# EAGLE schematic zoommar (EAGLE 5.07)
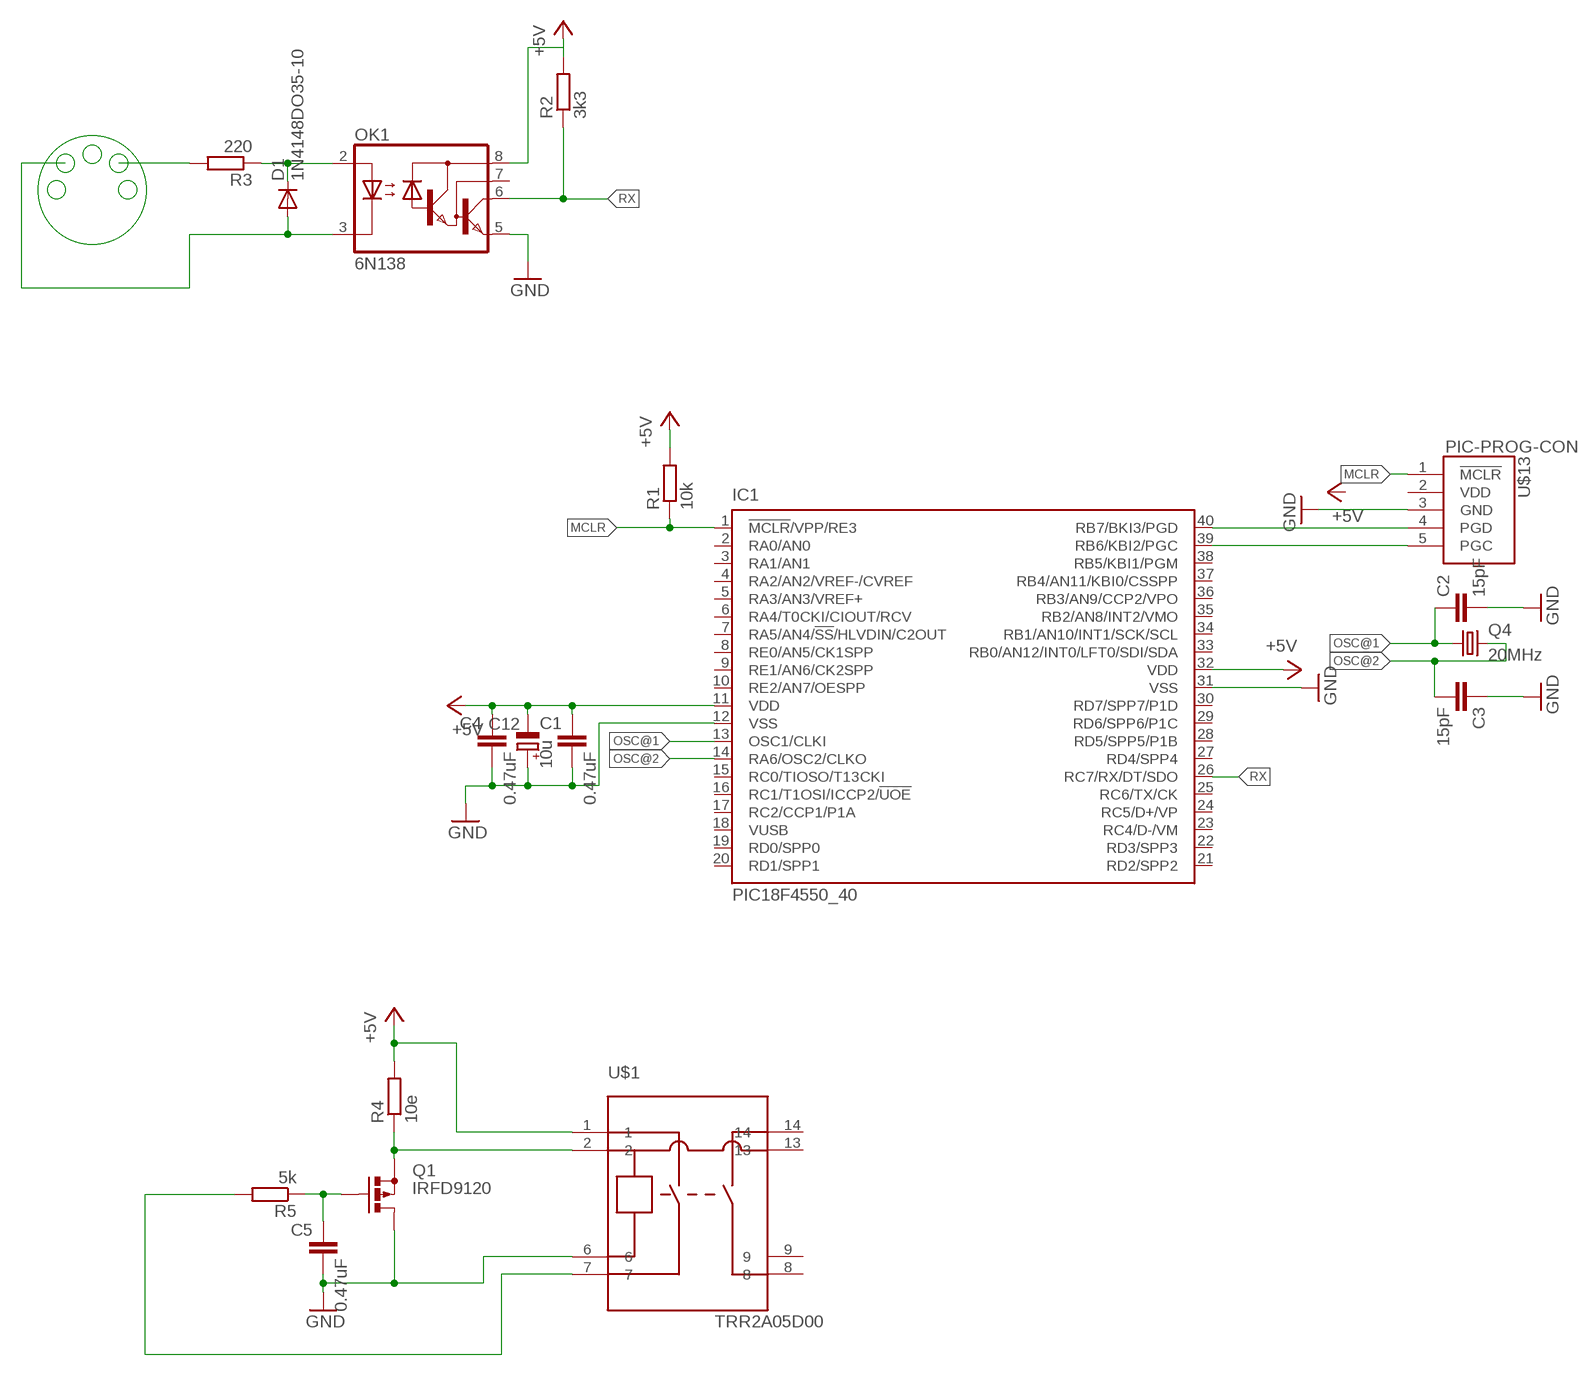
[diagram p0: schematic, sheet 1]

## Parts
C1  0.47uF  C-1206  [C1206]
C2  15pF  C-1206  [C1206]
C3  15pF  C-1206  [C1206]
C4  0.47uF  C-1206  [C1206]
C5  0.47uF  C-1206  [C1206]
C12  10u  CPOL-EUCT3528  [CT3528]
D1  1N4148DO35-10  [DO35-10]
IC1  PIC18F4550_40  [DIL40]
OK1  6N138  [DIL08]
Q1  IRFD9120  [C370-01]
Q4  20MHz  CRYSTALHC49S  [HC49/S]
R1  10k  R-EU_M1206  [M1206]
R2  3k3  R-EU_M1206  [M1206]
R3  220  R-EU_M1206  [M1206]
R4  10e  R-EU_M1206  [M1206]
R5  5k  R-EU_M1206  [M1206]
U$1  TRR2A05D00  [TRR_DIP]
U$13  PIC-PROG-CON  [PIC-PROG-CON]

## Nets
+5V: C1.2 C4.2 C12.- IC1.11(VDD) IC1.32(VDD) OK1.8(VCC) R1.2 R2.2 R4.2 U$1.1
GND [net8]: C1.1 C2.2 C3.1 C4.1 C5.1 C12.+ IC1.12(VSS) IC1.31(VSS) OK1.5(GND) Q1.D1 U$1.6 U$13.3(GND)
MCLR [net8]: IC1.1(!MCLR!/VPP/RE3) R1.1 U$13.1(!MCLR)
N$1: IC1.40(RB7/BKI3/PGD) U$13.4(PGD)
N$2: IC1.39(RB6/KBI2/PGC) U$13.5(PGC)
N$3: Q1.S R4.1 U$1.2
N$4: D1.C OK1.2(A) R3.1
N$5: R3.2
N$6: D1.A OK1.3(C)
N$7: C5.2 Q1.G R5.1
N$10: R5.2 U$1.7
OSC@1 [net8]: C2.1 Q4.1
OSC@2 [net8]: C3.2 Q4.2
RX: IC1.26(RC7/RX/DT/SDO) OK1.6(VO) R2.1
Unconnected: IC1.2(RA0/AN0) IC1.3(RA1/AN1) IC1.4(RA2/AN2/VREF-/CVREF) IC1.5(RA3/AN3/VREF+) IC1.6(RA4/T0CKI/CIOUT/RCV) IC1.7(RA5/AN4/!SS!/HLVDIN/C2OUT) IC1.8(RE0/AN5/CK1SPP) IC1.9(RE1/AN6/CK2SPP) IC1.10(RE2/AN7/OESPP) IC1.13(OSC1/CLKI) IC1.14(RA6/OSC2/CLKO) IC1.15(RC0/TIOSO/T13CKI) IC1.16(RC1/T1OSI/ICCP2/!UOE) IC1.17(RC2/CCP1/P1A) IC1.18(VUSB) IC1.19(RD0/SPP0) IC1.20(RD1/SPP1) IC1.21(RD2/SPP2) IC1.22(RD3/SPP3) IC1.23(RC4/D-/VM) IC1.24(RC5/D+/VP) IC1.25(RC6/TX/CK) IC1.27(RD4/SPP4) IC1.28(RD5/SPP5/P1B) IC1.29(RD6/SPP6/P1C) IC1.30(RD7/SPP7/P1D) IC1.33(RB0/AN12/INT0/LFT0/SDI/SDA) IC1.34(RB1/AN10/INT1/SCK/SCL) IC1.35(RB2/AN8/INT2/VMO) IC1.36(RB3/AN9/CCP2/VPO) IC1.37(RB4/AN11/KBI0/CSSPP) IC1.38(RB5/KBI1/PGM) OK1.7(VB) Q1.D U$1.8 U$1.9 U$1.13 U$1.14 U$13.2(VDD)

## Library data of the parts
C1-C5 = quantum-sensor:C: Capacitor
C12 = rcl:CPOL-EU: POLARIZED CAPACITOR, European symbol
D1 = diode:1N4148: DIODE high speed (Philips)
IC1 = microchip:PIC18F4*_40: USB Microcontrollers with nanoWatt Technology High-Performance, Enhanced Flash, 28/40/44-Pin, Source: http://ww1.microchip.com/downloads/en/devicedoc/39632c.pdf
OK1 = optocoupler:6N138: MOTOROLA OPTO COUPLER
Q1 = transistor-small-signal:IRFD9120: P-CHANNEL MOS FET
Q4 = crystal:CRYSTAL: CRYSTAL
R1-R5 = rcl:R-EU_: RESISTOR, European symbol
U$1 = trr_rele:TRR2A05D00: trr trr2a trr2a05d00
U$13 = pic_prog_con:PIC-PROG-CON: pic prog con pic_prog pic_prog_con

## Net classes
6 net8: width 0.203 mm